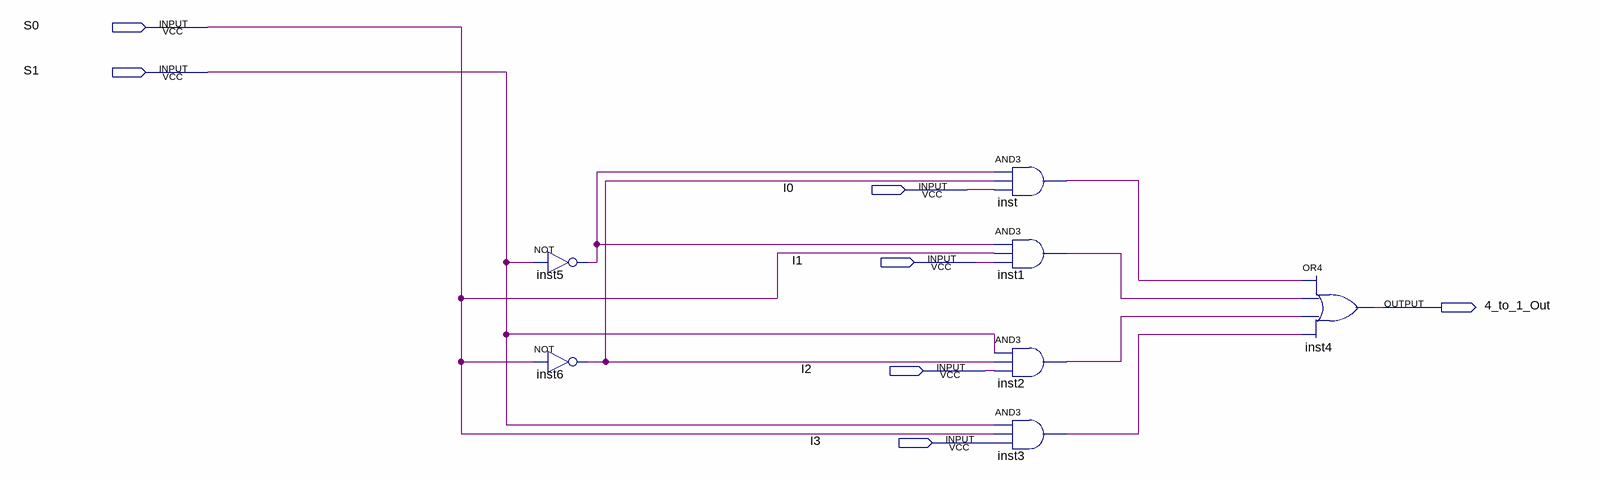
[diagram p0: schematic sheet]
// Quartus schematic Four_To_One_Multiplexer.bdf as structural Verilog: 7 symbols, 7 pins
module Four_To_One_Multiplexer (
  input  S0,
  input  S1,
  input  I0,
  input  I1,
  input  I2,
  input  I3,
  output \4_to_1_Out 
);

  wire inst1_out, inst2_out, inst3_out, inst5_out, inst6_out, inst_out;

  not inst5 (inst5_out, S1);
  not inst6 (inst6_out, S0);
  and inst (inst_out, inst5_out, inst6_out, I0);
  and inst1 (inst1_out, inst5_out, S0, I1);
  and inst2 (inst2_out, S1, inst6_out, I2);
  and inst3 (inst3_out, S1, S0, I3);
  or inst4 (\4_to_1_Out , inst_out, inst1_out, inst2_out, inst3_out);
endmodule
